# Altium schematic sheet INTERFACE.SchDoc
size A3; SheetNumber: 11; SheetTotal: 12
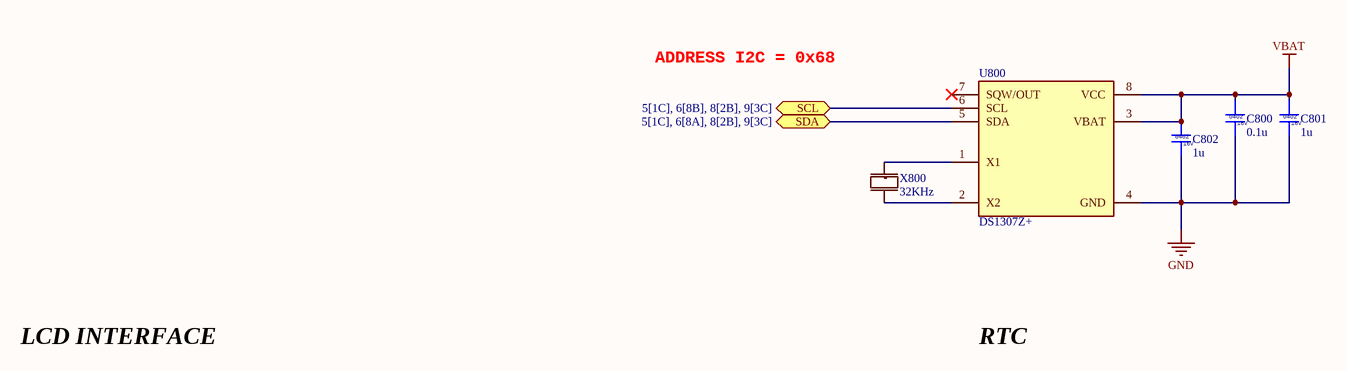
[diagram p0: INTERFACE.SchDoc]

## Parts
C800  0.1u  [CAP0402]
C801  1u  [CAP0402]
C802  1u  [CAP0402]
U800  DS1307Z+  [DS1307+]
X800  32KHz  [32Khz]

## Ports
SCL (bidir, see 5[1C], 6[8B], 8[2B], 9[3C]), SDA (bidir, see 5[1C], 6[8A], 8[2B], 9[3C])

## Nets
GND: C800.2 C801.2 C802.2 U800.4(GND)
VBAT: C800.1 C801.1 C802.1 U800.3(VBAT) U800.8(VCC)
SCL: U800.6(SCL) ; port SCL
SDA: U800.5(SDA) ; port SDA
NetU800_1: U800.1(X1) X800.1
NetU800_2: U800.2(X2) X800.2

Not connected (* = marked no-connect by the designer): U800 7(SQW/OUT)*

## Notes on the sheet
- ADDRESS I2C = 0x68
- LCD INTERFACE
- RTC

## Library data of the parts
C800 = C_0402_0.1u: Ceramic Capacitor, Multilayer, Ceramic, 16V, 10% +Tol, 10% -Tol, X7R, 15% TC, 0.1uF, Surface Mount, 0402; Manufacturer: Murata; Manufacturer Part Number: GRM155R71C104KA88J; Value: 100nF; Multilayer: Yes; Supplier: Digikey; Supplier Part Number: 490-6328-1-ND; RoHS: Yes; Category: Ceramic Capacitors; Stock: 19409569; Pricing: 1=0.1, 10=0.019, 50=0.011, 100=0.0086, 500=0.00646, 1000=0.00508, 2500=0.00462, 5000=0.00425 (USD); Mounting Technology: Surface Mount; Pins: 2; Dielectric Material: Ceramic; Package Shape: Rectangular; Case/Package: 0402; Terminal Finish: Nickel; Min Operating Temperature: -55°C; Max Operating Temperature: 125°C; JESD-609 Code: e3; Capacitor Type: Ceramic; Tolerance  (fill in as +-): 10%; Package Style: SMTMeter; Packaging: Tape and Reel; Tolerance (fill in as +-): 10%; Rated DC Voltage (URdc): 16V; Temperature Characteristics Code: X7R; Termination: Wraparound; Length: 1mm; Width: 0.5mm; Height: 0.5mm; Reach SVHC Compliant: Yes; RoHS Compliant: Yes; ComponentLink1URL: https://psearch.en.murata.com:443/capacitor/product/GRM155R71C104KA88%23.pdf?src-supplier=IHS+Markit; ComponentLink1Description: https://psearch.en.murata.com:443/capacitor/product/GRM155R71C104KA88%23.pdf?src-supplier=IHS+Markit; ComponentLink2URL: https://datasheet.ciiva.com/6271/product-6271168.pdf?src-supplier=Digikey; ComponentLink2Description: https://datasheet.ciiva.com/6271/product-6271168.pdf?src-supplier=Digikey; ComponentLink3URL: https://datasheet.ciiva.com/6271/grm155r71c104ka88-01-6271231.pdf?src-supplier=Digikey; ComponentLink3Description: https://datasheet.ciiva.com/6271/grm155r71c104ka88-01-6271231.pdf?src-supplier=Digikey
C801 C802 = C_0402_1u: Ceramic Capacitor, Multilayer, Ceramic, 16V, 10% +Tol, 10% -Tol, X5R, 15% TC, 1uF, Surface Mount, 0402; Manufacturer: Taiyo Yuden; Manufacturer Part Number: EMK105BJ105KV-F; Multilayer: Yes; Supplier: Digikey; Supplier Part Number: 587-2477-1-ND; RoHS: Yes; Category: Ceramic Capacitors; Stock: 2709915; Pricing: 1=0.1, 10=0.045, 50=0.031, 100=0.0266, 500=0.01912, 1000=0.01682, 2500=0.01437, 5000=0.01289 (USD); Mounting Technology: Surface Mount; Pins: 2; Dielectric Material: Ceramic; Package Shape: Rectangular; Case/Package: 0402; Terminal Finish: Nickel; Min Operating Temperature: -55°C; Max Operating Temperature: 85°C; JESD-609 Code: e3; Value: 1uF; Capacitor Type: Ceramic; Tolerance  (fill in as +-): 10%; Package Style: SMTMeter; Packaging: Tape and Reel; Tolerance (fill in as +-): 10%; Rated DC Voltage (URdc): 16V; Temperature Characteristics Code: X5R; Termination: Wraparound; Length: 1mm; Width: 0.5mm; Height: 0.5mm; Reach SVHC Compliant: Yes; RoHS Compliant: Yes; ComponentLink1URL: https://datasheet.ciiva.com:443/pdfs/VipMasterIC/IC/TAIY/TAIY-S-A0009096450/TAIY-S-A0009096597-1.pdf?src-supplier=IHS+Markit; ComponentLink1Description: https://datasheet.ciiva.com:443/pdfs/VipMasterIC/IC/TAIY/TAIY-S-A0009096450/TAIY-S-A0009096597-1.pdf?src-supplier=IHS+Markit; ComponentLink2URL: https://datasheet.ciiva.com/134/emk105bj105kv-f-ss-134209.pdf?src-supplier=Digikey; ComponentLink2Description: https://datasheet.ciiva.com/134/emk105bj105kv-f-ss-134209.pdf?src-supplier=Digikey; ComponentLink3URL: https://datasheet.ciiva.com/15920/964emk105bj105kv-f-15920402.pdf?src-supplier=Onlinecomponents.com; ComponentLink3Description: https://datasheet.ciiva.com/15920/964emk105bj105kv-f-15920402.pdf?src-supplier=Onlinecomponents.com; ComponentLink4URL: https://datasheet.ciiva.com/26871/getdatasheetpartid-638287-26871289.pdf?src-supplier=Verical; ComponentLink4Description: https://datasheet.ciiva.com/26871/getdatasheetpartid-638287-26871289.pdf?src-supplier=Verical; ComponentLink5URL: https://datasheet.ciiva.com/30259/265emk105bj105kv-f-30259872.pdf?src-supplier=Onlinecomponents.com; ComponentLink5Description: https://datasheet.ciiva.com/30259/265emk105bj105kv-f-30259872.pdf?src-supplier=Onlinecomponents.com; ComponentLink6URL: https://datasheet.ciiva.com/7657/1497285-7657320.pdf?src-supplier=Element14; ComponentLink6Description: https://datasheet.ciiva.com/7657/1497285-7657320.pdf?src-supplier=Element14; ComponentLink7URL: https://datasheet.ciiva.com/22694/1497285-22694239.pdf?src-supplier=Element14; ComponentLink7Description: https://datasheet.ciiva.com/22694/1497285-22694239.pdf?src-supplier=Element14; ComponentLink8URL: https://datasheet.ciiva.com/5424/mlcc01-e-5424190.pdf?src-supplier=Mouser; ComponentLink8Description: https://datasheet.ciiva.com/5424/mlcc01-e-5424190.pdf?src-supplier=Mouser
U800 = DS1307Z+: Real Time Clock, Volatile, 1 Timer(s), CMOS, PDSO8; Manufacturer: Maxim; Package Body Material: Plastic; Number of Timers/Counters: 1; Max Supply Voltage: 5.5V; Min Supply Voltage: 4.5V; Nominal Supply Voltage: 5V; Clock Frequency: 32kHz; Package Equivalence Code: SOP8,.25; Qualification Status: Not Qualified; Supplier: Digikey; Supplier Part Number: DS1307Z+-ND; Manufacturer Part Number: DS1307Z+; RoHS: Yes; Category: Real Time Clocks; Stock: 5076; Pricing: 1=5.05, 10=4.535, 25=4.2868, 100=3.7153, 300=3.5248, 500=3.16278, 1000=2.66741, 2500=2.53404 (USD); Case/Package: SOP; Pins: 8; Package Shape: Rectangular; Terminal Finish: Tin; Min Operating Temperature: 0°C; Max Operating Temperature: 70°C; JESD-30 Code: R-PDSO-G8; Package Style: SMALL OUTLINEMeter; Surface Mount: Yes; Technology: CMOS; Terminal Form: Gull Wing; Terminal Position: DUAL; JESD-609 Code: e3; Moisture Sensitivity Level: 1; Peak Reflow Temperature (Cel): 260°C; Power Supplies: 5V; Length: 4.9mm; Width: 3.9mm; Height - Seated (Max): 1.75mm; Terminal Pitch: 1.27mm; Temperature Grade: COMMERCIAL; Reach SVHC Compliant: Yes; RoHS Compliant: Yes; ComponentLink1URL: https://datasheet.ciiva.com:443/pdfs/VipMasterIC/IC/MAXM/MAXM-S-A0000633411/MAXM-S-A0000664014-1.pdf?src-supplier=IHS+Markit; ComponentLink1Description: https://datasheet.ciiva.com:443/pdfs/VipMasterIC/IC/MAXM/MAXM-S-A0000633411/MAXM-S-A0000664014-1.pdf?src-supplier=IHS+Markit; ComponentLink2URL: https://datasheet.ciiva.com/14085/ds1307-14085608.pdf?src-supplier=Digikey; ComponentLink2Description: https://datasheet.ciiva.com/14085/ds1307-14085608.pdf?src-supplier=Digikey; ComponentLink3URL: https://datasheet.ciiva.com/1498/ds1307-1498866.pdf?src-supplier=Farnell; ComponentLink3Description: https://datasheet.ciiva.com/1498/ds1307-1498866.pdf?src-supplier=Farnell; ComponentLink4URL: https://datasheet.ciiva.com/3304/ds1307-3304457.pdf?src-supplier=Avnet; ComponentLink4Description: https://datasheet.ciiva.com/3304/ds1307-3304457.pdf?src-supplier=Avnet; ComponentLink5URL: https://datasheet.ciiva.com/14577/70127931-14577227.pdf?src-supplier=Allied+Electronics; ComponentLink5Description: https://datasheet.ciiva.com/14577/70127931-14577227.pdf?src-supplier=Allied+Electronics; ComponentLink6URL: https://datasheet.ciiva.com/1491/ds1307-1491905.pdf?src-supplier=Element14; ComponentLink6Description: https://datasheet.ciiva.com/1491/ds1307-1491905.pdf?src-supplier=Element14; ComponentLink7URL: https://datasheet.ciiva.com/1139/46359-1139142.pdf?src-supplier=Element14; ComponentLink7Description: https://datasheet.ciiva.com/1139/46359-1139142.pdf?src-supplier=Element14; Supplier 1: Digikey; Supplier Part Number 1: DS1307Z+-ND
X800 = CM8V-T1A-32.768KHZ-12.5PF-20PPM-TA-QA: CRYSTAL 32.7680KHZ 12.5PF SMD; Manufacturer: Micro Crystal; Supplier: Digikey; Supplier Part Number: 2195-CM8V-T1A-32.768KHZ-12.5PF-20PPM-TA-QACT-ND; Manufacturer Part Number: CM8V-T1A-32.768KHZ-12.5PF-20PPM-TA-QA; RoHS: No; Category: LDO; Stock: 22759; Pricing: 1=0.43, 10=0.366, 50=0.33, 100=0.3156, 500=0.28466 (USD); Supplier 1: Digikey; Supplier Part Number 1: 2195-CM8V-T1A-32.768KHZ-12.5PF-20PPM-TA-QACT-ND